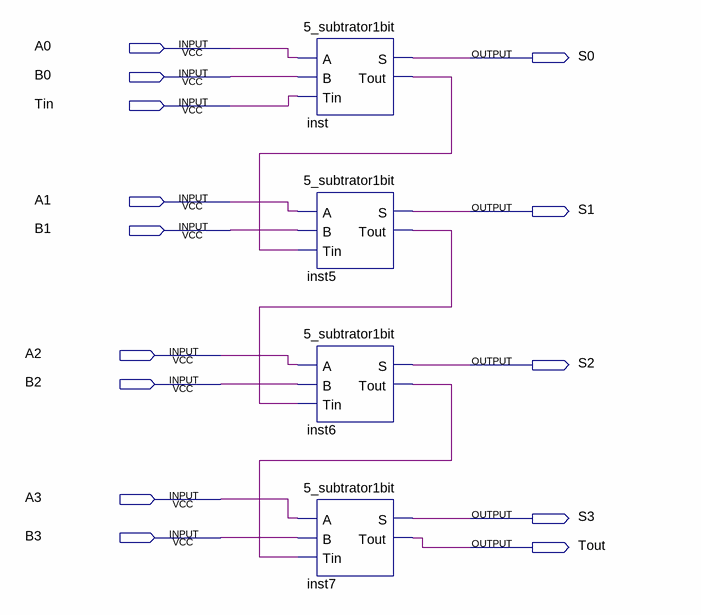
[diagram p0: schematic sheet]
// Quartus schematic 5_subtrator4bits.bdf as structural Verilog: 4 symbols, 14 pins
module \5_subtrator4bits  (
  input  A0,
  input  B0,
  input  Tin,
  input  A1,
  input  B1,
  input  A2,
  input  B2,
  input  A3,
  input  B3,
  output S0,
  output S1,
  output S2,
  output S3,
  output Tout
);

  wire inst5_tout, inst6_tout, inst_tout;

  \5_subtrator1bit  inst (.A(A0), .B(B0), .Tin(Tin), .S(S0), .Tout(inst_tout));
  \5_subtrator1bit  inst5 (.A(A1), .B(B1), .Tin(inst_tout), .S(S1), .Tout(inst5_tout));
  \5_subtrator1bit  inst6 (.A(A2), .B(B2), .Tin(inst5_tout), .S(S2), .Tout(inst6_tout));
  \5_subtrator1bit  inst7 (.A(A3), .B(B3), .Tin(inst6_tout), .S(S3), .Tout(Tout));
endmodule
